# Altium schematic sheet stepper_motor.SchDoc
size A4; Engineer: Amir Hossein Jobeiri; Organization: Simaran; SheetNumber: 3; SheetTotal: 25
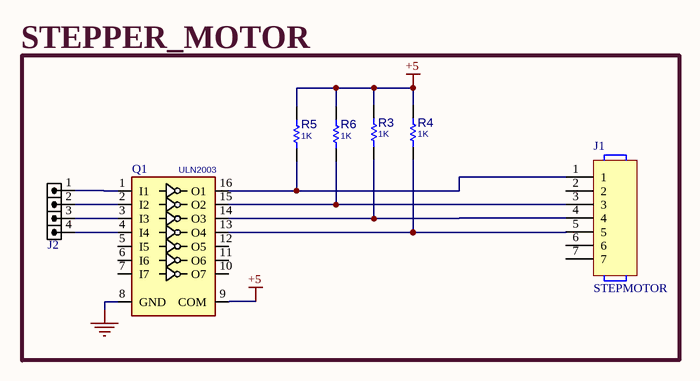
[diagram p0: stepper_motor.SchDoc]

## Parts
J1  STEPMOTOR
J2  HDR1X4  [HDRMINI_M_1X4]  (value not drawn)
Q1  ULN2003  [DIP_16]
R3  1K  [R025W_AX04]
R4  1K  [R025W_AX04]
R5  1K  [R025W_AX04]
R6  1K  [R025W_AX04]

## Blocks framed on the sheet
STEPPER_MOTOR: J1 J2 Q1 R3-R6

## Nets
+5: Q1.9(COM) R3.1 R4.1 R5.1 R6.1
GND: Q1.8(GND)
NetJ1_1: J1.1 Q1.16(O1) R5.2
NetJ1_3: J1.3 Q1.15(O2) R6.2
NetJ1_4: J1.4 Q1.14(O3) R3.2
NetJ1_5: J1.5 Q1.13(O4) R4.2
NetJ2_1: J2.1 Q1.1(I1)
NetJ2_2: J2.2 Q1.2(I2)
NetJ2_3: J2.3 Q1.3(I3)
NetJ2_4: J2.4 Q1.4(I4)

Not connected (* = marked no-connect by the designer): J1 2 6 7; Q1 5(I5) 6(I6) 7(I7) 10(O7) 11(O6) 12(O5)

## Library data of the parts
J1 = STEP_MOTOR_CONNECTOR: VALUE: STEPMOTOR; PARAM1: *; PARAM: *; Parameter 1: *
J2 = HDRMINI_M_1X4: CONN, HEADER, Male, pitch: 1.27mm, 4POS; VALUE: HDRMINI_4
Q1 = ULN2003_DIP16: Darlington, 7-CH, 50V, 0.5A; MANF_P#: ULN2003A; MANF: DIODES; PARAM: 7-CH, 50V, 0.5A; PARAM2: -; VALUE: ULN2003
R3-R6 = RES_THD: RESISTOR, THD; MANF_P#: RK73H1ETTP4701F; MANF: KOA SPEER; PARAM: 0.063W; DESC: DESCRIPTION; DIST#: MOUSER; PARAM2: 1%; ASSEMBLY: ASSEMBLY; PRICE: 100= 0.5$; VALUE: 1K